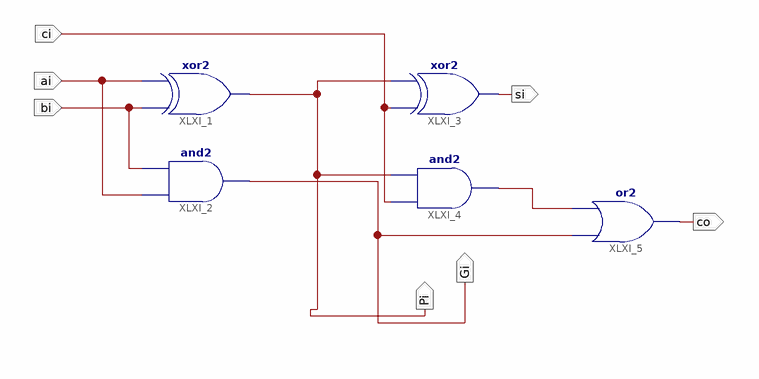
[diagram p0: schematic sheet 1]
// Xilinx ISE schematic add.sch (kintex7) as structural Verilog: 5 symbols, 7 ports
module add (
  input  ai,
  input  bi,
  input  ci,
  output Pi,
  output si,
  output Gi,
  output co
);

  wire XLXN_11;

  xor XLXI_1 (Pi, bi, ai);
  and XLXI_2 (Gi, ai, bi);
  xor XLXI_3 (si, ci, Pi);
  and XLXI_4 (XLXN_11, ci, Pi);
  or XLXI_5 (co, Gi, XLXN_11);
endmodule
